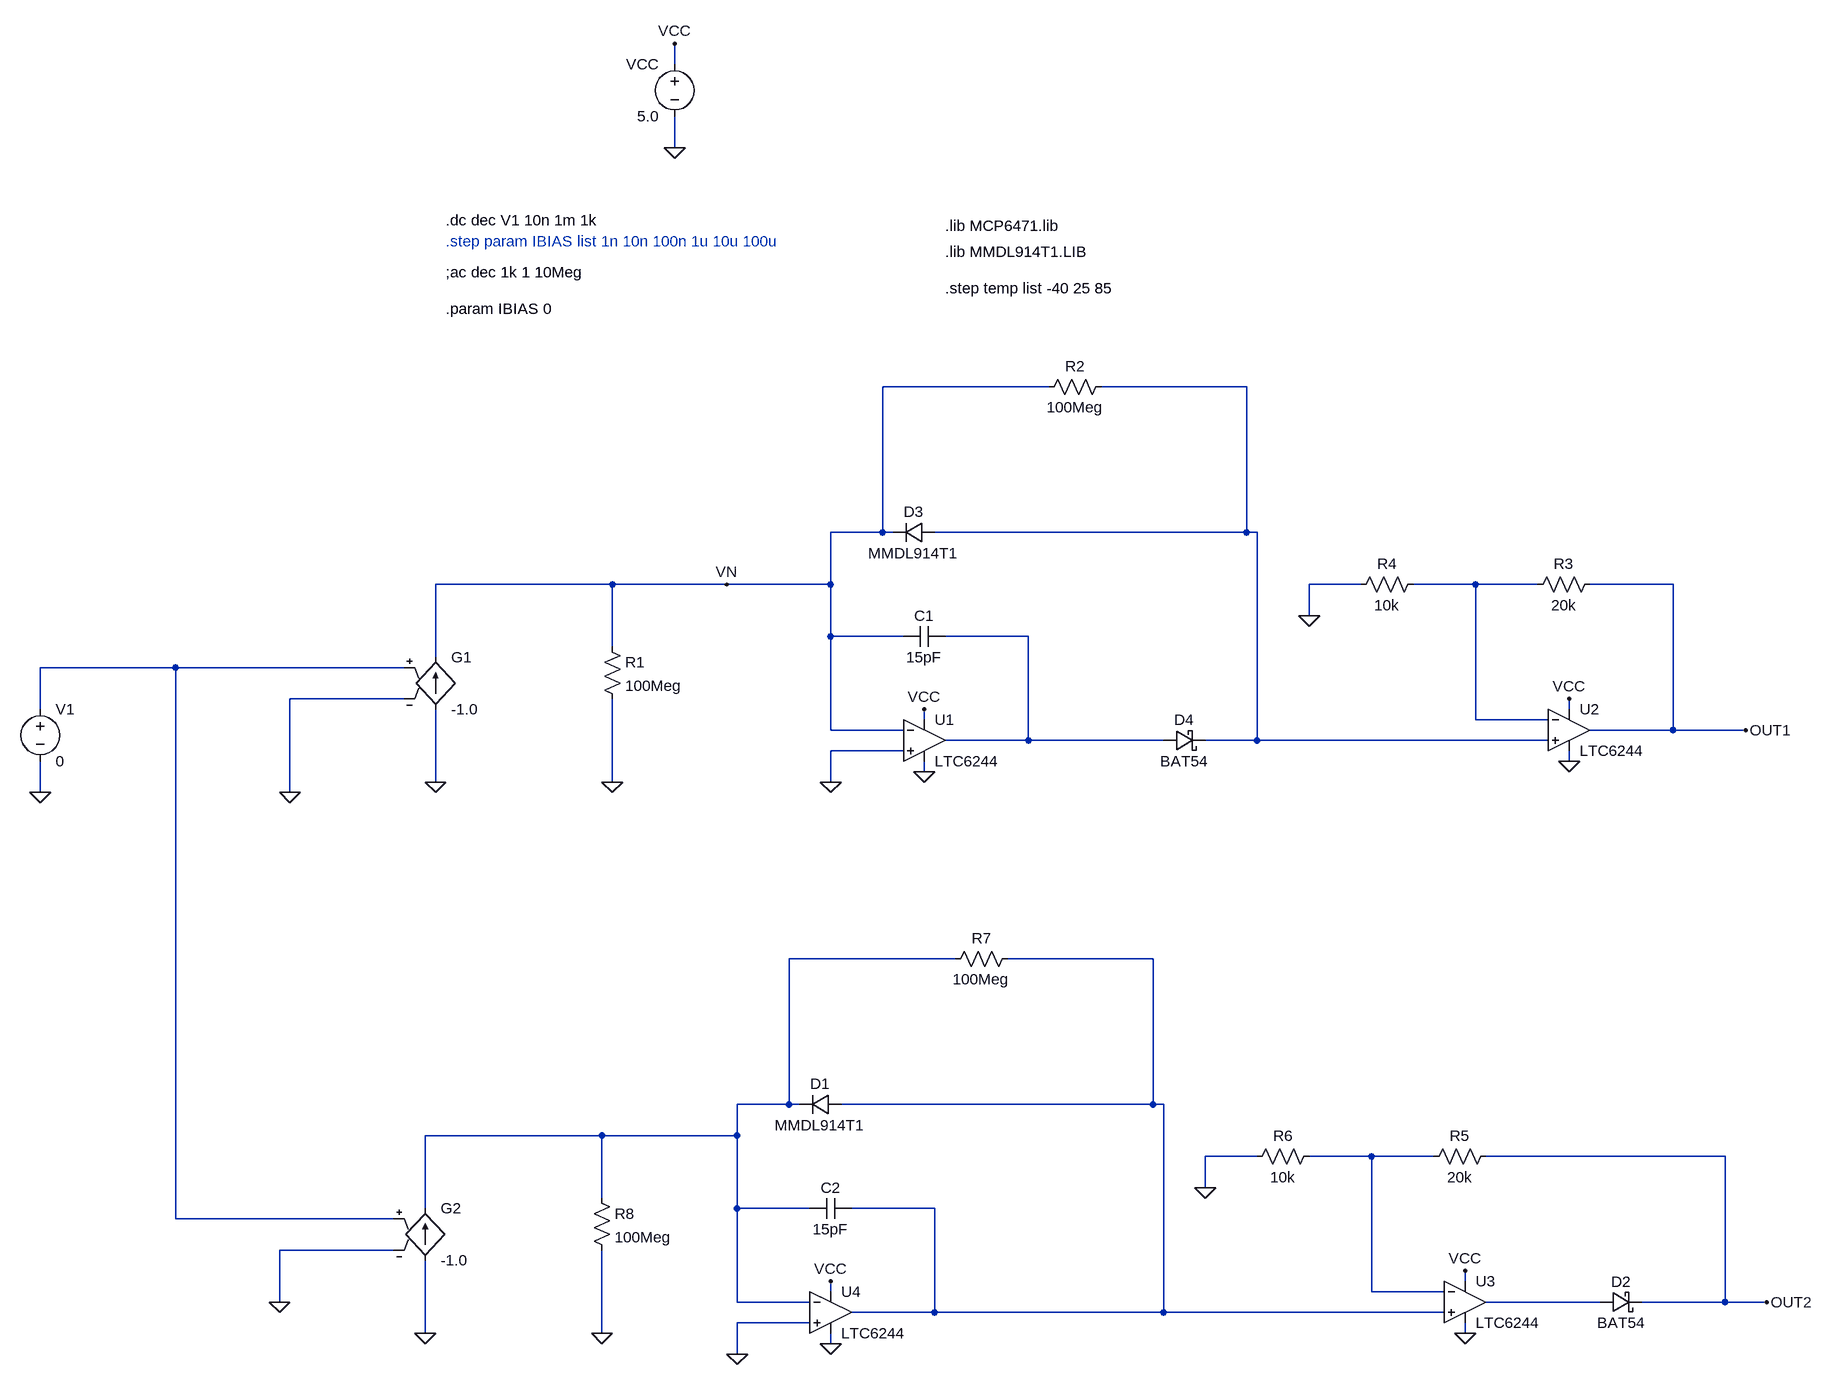
[diagram p0: schematic Log_Current_Amp_Configurations_Sim.asc]
Log_Current_Amp_Configurations_Sim.asc, the LTspice schematic file:
Version 4
SHEET 1 1312 1200
WIRE -448 -928 -448 -960
WIRE -448 -800 -448 -848
WIRE 128 -432 -128 -432
WIRE 432 -432 208 -432
WIRE -128 -208 -128 -432
WIRE -128 -208 -208 -208
WIRE -112 -208 -128 -208
WIRE 432 -208 432 -432
WIRE 432 -208 -48 -208
WIRE 448 -208 432 -208
WIRE -544 -128 -816 -128
WIRE -368 -128 -544 -128
WIRE -208 -128 -208 -208
WIRE -208 -128 -368 -128
WIRE 608 -128 528 -128
WIRE 784 -128 688 -128
WIRE 880 -128 784 -128
WIRE 1088 -128 960 -128
WIRE 528 -80 528 -128
WIRE -208 -48 -208 -128
WIRE -96 -48 -208 -48
WIRE 96 -48 -32 -48
WIRE -544 -32 -544 -128
WIRE -816 -16 -816 -128
WIRE -1216 0 -1424 0
WIRE -864 0 -1216 0
WIRE -864 48 -1040 48
WIRE -1424 64 -1424 0
WIRE 928 64 928 48
WIRE -64 80 -64 64
WIRE 784 80 784 -128
WIRE 896 80 784 80
WIRE -208 96 -208 -48
WIRE -96 96 -208 96
WIRE 1088 96 1088 -128
WIRE 1088 96 960 96
WIRE 1200 96 1088 96
WIRE 96 112 96 -48
WIRE 96 112 -32 112
WIRE 304 112 96 112
WIRE 448 112 448 -208
WIRE 448 112 368 112
WIRE 896 112 448 112
WIRE -96 128 -208 128
WIRE 928 144 928 128
WIRE -64 160 -64 144
WIRE -816 176 -816 64
WIRE -544 176 -544 48
WIRE -208 176 -208 128
WIRE -1424 192 -1424 144
WIRE -1040 192 -1040 48
WIRE -16 448 -272 448
WIRE 288 448 64 448
WIRE -272 672 -272 448
WIRE -272 672 -352 672
WIRE -256 672 -272 672
WIRE 288 672 288 448
WIRE 288 672 -192 672
WIRE 304 672 288 672
WIRE -560 720 -832 720
WIRE -352 720 -352 672
WIRE -352 720 -560 720
WIRE 448 752 368 752
WIRE 624 752 528 752
WIRE 720 752 624 752
WIRE 1168 752 800 752
WIRE 368 800 368 752
WIRE -560 816 -560 720
WIRE -832 832 -832 720
WIRE -352 832 -352 720
WIRE -240 832 -352 832
WIRE -48 832 -176 832
WIRE -1216 848 -1216 0
WIRE -880 848 -1216 848
WIRE -880 896 -1056 896
WIRE 768 944 768 928
WIRE -208 960 -208 944
WIRE 624 960 624 752
WIRE 736 960 624 960
WIRE -1056 976 -1056 896
WIRE -352 976 -352 832
WIRE -240 976 -352 976
WIRE 976 976 800 976
WIRE 1168 976 1168 752
WIRE 1168 976 1040 976
WIRE 1232 976 1168 976
WIRE -48 992 -48 832
WIRE -48 992 -176 992
WIRE 304 992 304 672
WIRE 304 992 -48 992
WIRE 736 992 304 992
WIRE -240 1008 -352 1008
WIRE -832 1024 -832 912
WIRE -560 1024 -560 896
WIRE 768 1024 768 1008
WIRE -208 1040 -208 1024
WIRE -352 1056 -352 1008
FLAG -64 160 0
FLAG -64 64 VCC
FLAG -208 176 0
FLAG -448 -960 VCC
FLAG -448 -800 0
FLAG -544 176 0
FLAG -368 -128 VN
FLAG 928 144 0
FLAG 928 48 VCC
FLAG 528 -80 0
FLAG 1200 96 OUT1
FLAG 768 1024 0
FLAG 768 928 VCC
FLAG 368 800 0
FLAG 1232 976 OUT2
FLAG -208 1040 0
FLAG -208 944 VCC
FLAG -352 1056 0
FLAG -1424 192 0
FLAG -816 176 0
FLAG -1040 192 0
FLAG -560 1024 0
FLAG -832 1024 0
FLAG -1056 976 0
SYMBOL diode -48 -192 M270
WINDOW 0 32 32 VTop 2
WINDOW 3 0 32 VBottom 2
SYMATTR InstName D3
SYMATTR Value MMDL914T1
SYMBOL cap -32 -64 R90
WINDOW 0 0 32 VBottom 2
WINDOW 3 32 32 VTop 2
SYMATTR InstName C1
SYMATTR Value 15pF
SYMBOL schottky 304 96 M90
WINDOW 0 0 32 VBottom 2
WINDOW 3 32 32 VTop 2
SYMATTR InstName D4
SYMATTR Value BAT54
SYMATTR Description Diode
SYMATTR Type diode
SYMBOL voltage -448 -944 M0
WINDOW 123 0 0 Left 0
WINDOW 39 0 0 Left 0
SYMATTR InstName VCC
SYMATTR Value 5.0
SYMBOL res -560 -48 R0
SYMATTR InstName R1
SYMATTR Value 100Meg
SYMBOL res 224 -448 R90
WINDOW 0 0 56 VBottom 2
WINDOW 3 32 56 VTop 2
SYMATTR InstName R2
SYMATTR Value 100Meg
SYMBOL Opamps\\LTC6244 -64 112 R0
SYMATTR InstName U1
SYMBOL Opamps\\LTC6244 928 96 R0
SYMATTR InstName U2
SYMBOL res 976 -144 R90
WINDOW 0 0 56 VBottom 2
WINDOW 3 32 56 VTop 2
SYMATTR InstName R3
SYMATTR Value 20k
SYMBOL res 704 -144 R90
WINDOW 0 0 56 VBottom 2
WINDOW 3 32 56 VTop 2
SYMATTR InstName R4
SYMATTR Value 10k
SYMBOL Opamps\\LTC6244 768 976 R0
SYMATTR InstName U3
SYMBOL res 816 736 R90
WINDOW 0 0 56 VBottom 2
WINDOW 3 32 56 VTop 2
SYMATTR InstName R5
SYMATTR Value 20k
SYMBOL res 544 736 R90
WINDOW 0 0 56 VBottom 2
WINDOW 3 32 56 VTop 2
SYMATTR InstName R6
SYMATTR Value 10k
SYMBOL diode -192 688 M270
WINDOW 0 32 32 VTop 2
WINDOW 3 0 32 VBottom 2
SYMATTR InstName D1
SYMATTR Value MMDL914T1
SYMBOL cap -176 816 R90
WINDOW 0 0 32 VBottom 2
WINDOW 3 32 32 VTop 2
SYMATTR InstName C2
SYMATTR Value 15pF
SYMBOL schottky 976 960 M90
WINDOW 0 0 32 VBottom 2
WINDOW 3 32 32 VTop 2
SYMATTR InstName D2
SYMATTR Value BAT54
SYMATTR Description Diode
SYMATTR Type diode
SYMBOL res 80 432 R90
WINDOW 0 0 56 VBottom 2
WINDOW 3 32 56 VTop 2
SYMATTR InstName R7
SYMATTR Value 100Meg
SYMBOL Opamps\\LTC6244 -208 992 R0
SYMATTR InstName U4
SYMBOL voltage -1424 48 R0
WINDOW 123 0 0 Left 0
WINDOW 39 0 0 Left 0
SYMATTR InstName V1
SYMATTR Value 0
SYMBOL g -816 -32 R0
SYMATTR InstName G1
SYMATTR Value -1.0
SYMBOL res -576 800 R0
SYMATTR InstName R8
SYMATTR Value 100Meg
SYMBOL g -832 816 R0
SYMATTR InstName G2
SYMATTR Value -1.0
TEXT -32 -680 Left 2 !.lib MCP6471.lib
TEXT -32 -640 Left 2 !.lib MMDL914T1.LIB
TEXT -800 -688 Left 2 !.dc dec V1 10n 1m 1k
TEXT -32 -584 Left 2 !.step temp list -40 25 85
TEXT -800 -656 Left 2 ;.step param IBIAS list 1n 10n 100n 1u 10u 100u
TEXT -800 -608 Left 2 !;ac dec 1k 1 10Meg
TEXT -800 -552 Left 2 !.param IBIAS 0

The netlist it stands for:
* Log_Current_Amp_Configurations_Sim.asc
D3 N001 VN MMDL914T1
C1 N003 VN 15pF
D4 N003 N001 BAT54
VCC VCC 0 5.0
R1 VN 0 100Meg
R2 N001 VN 100Meg
XU1 0 VN VCC 0 N003 LTC6244  ; pins In+ In- V+ V- OUT
XU2 N001 N002 VCC 0 OUT1 LTC6244  ; pins In+ In- V+ V- OUT
R3 OUT1 N002 20k
R4 N002 0 10k
XU3 N006 N007 VCC 0 N008 LTC6244  ; pins In+ In- V+ V- OUT
R5 OUT2 N007 20k
R6 N007 0 10k
D1 N006 N005 MMDL914T1
C2 N006 N005 15pF
D2 N008 OUT2 BAT54
R7 N006 N005 100Meg
XU4 0 N005 VCC 0 N006 LTC6244  ; pins In+ In- V+ V- OUT
V1 N004 0 0
G1 0 VN N004 0 -1.0
R8 N005 0 100Meg
G2 0 N005 N004 0 -1.0
.model D D
.lib standard.dio
.lib MCP6471.lib
.lib MMDL914T1.LIB
.dc dec V1 10n 1m 1k
.step temp list -40 25 85
* .step param IBIAS list 1n 10n 100n 1u 10u 100u
;ac dec 1k 1 10Meg
.param IBIAS 0
.backanno
.end